# EAGLE schematic power_on_board (EAGLE 9.0.0)
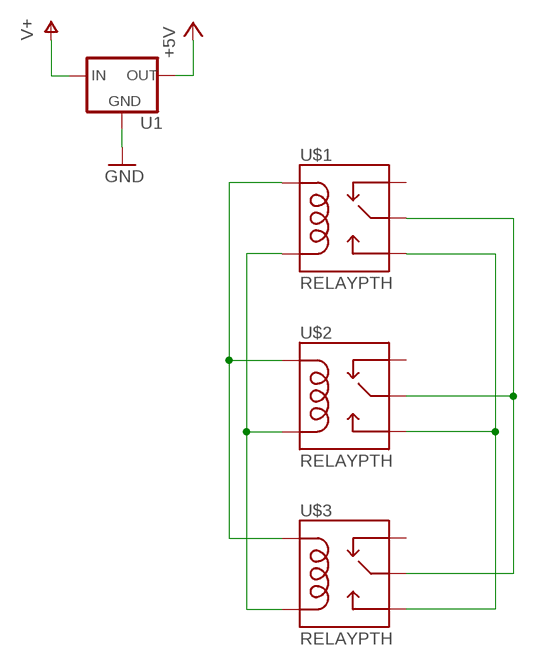
[diagram p0: schematic, sheet 1]

## Parts
U1  V_REG_78XX-TO-220  [TO-220-ALT]
U$1  RELAYPTH  [SRD-05VDC-SL-C]
U$2  RELAYPTH  [SRD-05VDC-SL-C]
U$3  RELAYPTH  [SRD-05VDC-SL-C]

## Nets
+5V: U1.OUT
GND: U1.GND
N$1: U$1.SWCOMMON U$2.SWCOMMON U$3.SWCOMMON
N$2: U$1.SWOPEN U$2.SWOPEN U$3.SWOPEN
N$3: U$1.COIL1 U$2.COIL1 U$3.COIL1
N$4: U$1.COIL0 U$2.COIL0 U$3.COIL0
V+: U1.IN
Unconnected: U$1.SWCLOSED(SWCLOSE) U$2.SWCLOSED(SWCLOSE) U$3.SWCLOSED(SWCLOSE)

## Library data of the parts
U1 = SparkFun-IC-Power:V_REG_78XX: Voltage Regulator Standard 78xx regulator. IGO (Input Ground Output). Spark Fun Electronics SKU : COM-00107; PROD_ID: VREG-08450; SF_ID: COM-00107
U$1-U$3 = SRD-05VDC-SL-C:RELAY: SPDT relay (COM-00101)